# Altium project main.PrjPCB
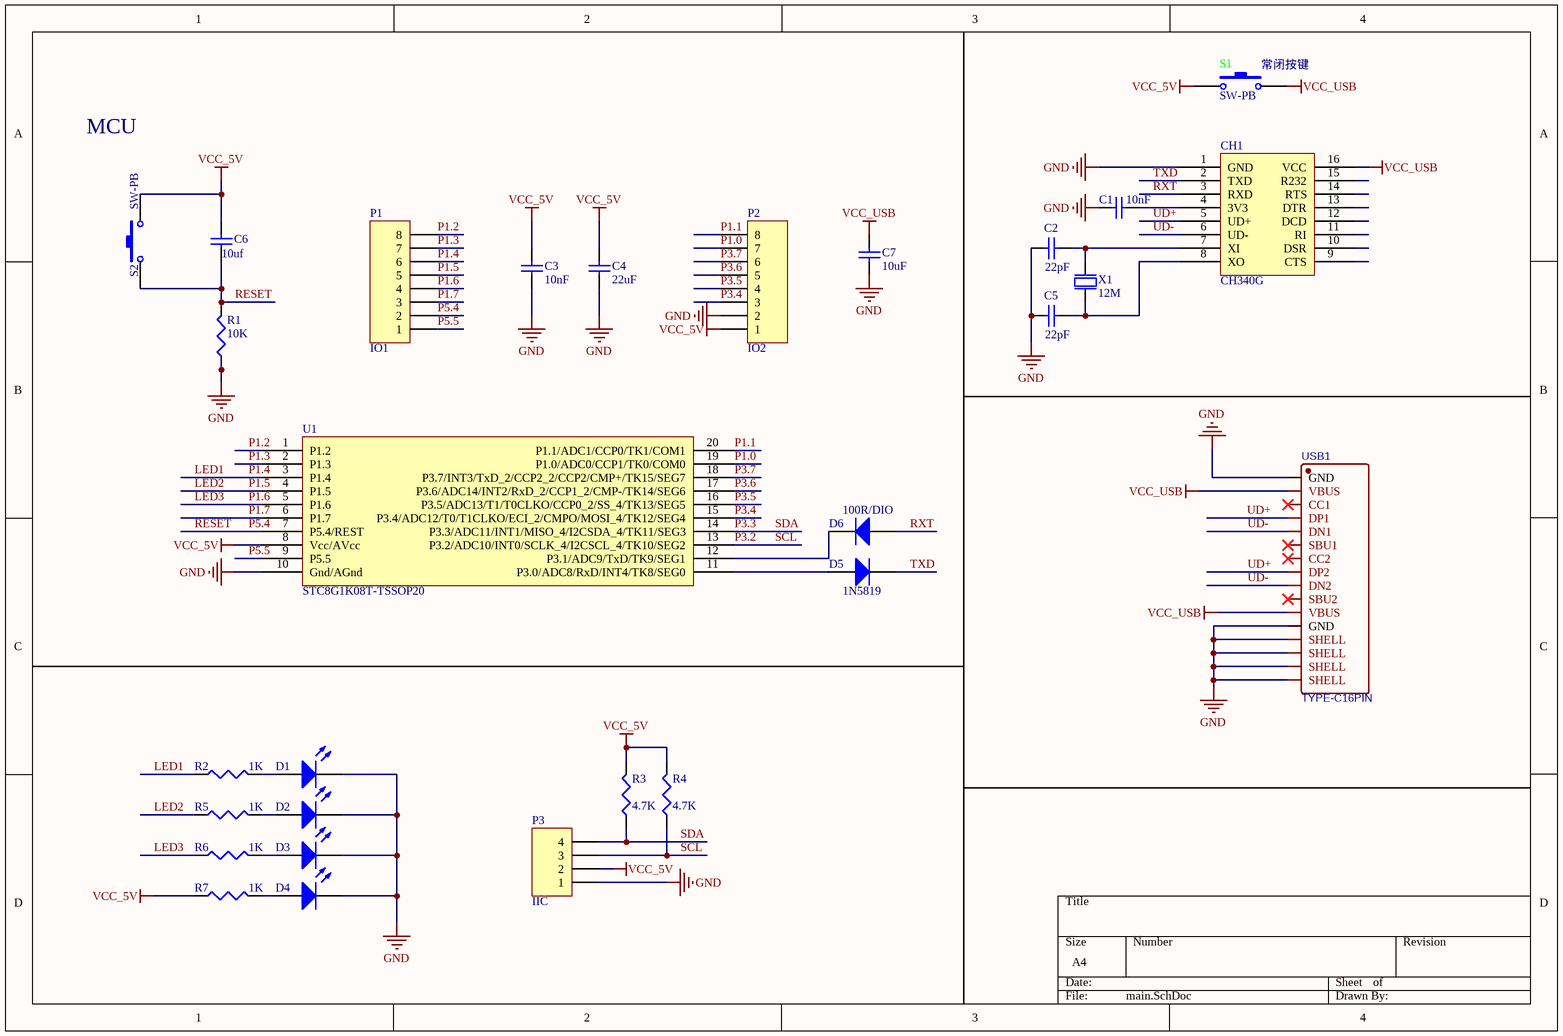
[diagram p0: main.SchDoc]
1 sheet, 29 parts. Net scope: global (net labels, ports and power ports of the same name join across sheets).
Board file: PCB1.PcbDoc

## Sheet main.SchDoc
size A4

### Parts
C1  value 10nF  [C0603]  (hidden comment: Cap Semi)
C2  value 22pF  [0402]  (hidden comment: Cap Semi)
C3  10nF  [C0603]
C4  22uF  [C0603]
C5  value 22pF  [0402]  (hidden comment: Cap Semi)
C6  value 10uf  [C0603]
C7  10uF  [C0603]
CH1  (no value)  [SOIC127P600X170-16N]
D1  LED3  [0603D]  (value not drawn)
D2  LED3  [0603D]  (value not drawn)
D3  LED3  [0603D]  (value not drawn)
D4  LED3  [0603D]  (value not drawn)
D5  100R/DIO  [0603D]
D6  1N5819  [0603D]
P1  IO1  [HDR1X8]
P2  IO2  [HDR1X8]
P3  IIC  [HDR1X4]
R1  10K  [J1-0603]
R2  1K  [J1-0603]
R3  value 4.7K  [J1-0603]  (hidden comment: Res3)
R4  value 4.7K  [J1-0603]  (hidden comment: Res3)
R5  1K  [J1-0603]
R6  1K  [J1-0603]
R7  1K  [J1-0603]
S1  SW-PB  [KEY_1]
S2  SW-PB  [KEY_1]
U1  STC8G1K08T-TSSOP20  [TSSOP20]
USB1  TYPE-C16PIN  [USB-C-SMD_TYPE-C16PIN]
X1  12M  [LC_SMD-3225_4P]

### Nets
GND: C1.2 C2.1 C3.1 C4.1 C5.1 C7.1 CH1.1(GND) D1.2(K) D2.2(K) D3.2(K) D4.2(K) P2.2 P3.1 R1.1 U1.10(Gnd/AGnd) USB1.1(SHELL) USB1.2(SHELL) USB1.3(SHELL) USB1.4(SHELL) USB1.A1B12(GND) USB1.B1A12(GND) X1.2(GND) X1.4(GND)
VCC_5V: C3.2 C4.2 C6.2 P2.1 P3.2 R3.2 R4.2 R7.1 S1.1 S2.2 U1.8(Vcc/AVcc)
VCC_USB: C7.2 CH1.16(VCC) S1.2 USB1.A4B9(VBUS) USB1.B4A9(VBUS)
LED1: P1.6 R2.1 U1.3(P1.4)  [also labelled P1.4]
LED2: P1.5 R5.1 U1.4(P1.5)  [also labelled P1.5]
LED3: P1.4 R6.1 U1.5(P1.6)  [also labelled P1.6]
P1.0: P2.7 U1.19(P1.0/ADC0/CCP1/TK0/COM0)
P1.1: P2.8 U1.20(P1.1/ADC1/CCP0/TK1/COM1)
P1.2: P1.8 U1.1(P1.2)
P1.3: P1.7 U1.2(P1.3)
P1.7: P1.3 U1.6(P1.7)
P3.2: P3.3 R4.1 U1.13(P3.2/ADC10/INT0/SCLK_4/I2CSCL_4/TK10/SEG2)  [also labelled SCL]
P3.3: P3.4 R3.1 U1.14(P3.3/ADC11/INT1/MISO_4/I2CSDA_4/TK11/SEG3)  [also labelled SDA]
P3.4: P2.3 U1.15(P3.4/ADC12/T0/T1CLKO/ECI_2/CMPO/MOSI_4/TK12/SEG4)
P3.5: P2.4 U1.16(P3.5/ADC13/T1/T0CLKO/CCP0_2/SS_4/TK13/SEG5)
P3.6: P2.5 U1.17(P3.6/ADC14/INT2/RxD_2/CCP1_2/CMP-/TK14/SEG6)
P3.7: P2.6 U1.18(P3.7/INT3/TxD_2/CCP2_2/CCP2/CMP+/TK15/SEG7)
P5.4: C6.1 P1.2 R1.2 S2.1 U1.7(P5.4/REST)  [also labelled RESET]
P5.5: P1.1 U1.9(P5.5)
RXT: CH1.3(RXD) D6.1(A)
TXD: CH1.2(TXD) D5.2(K)
UD+: CH1.5(UD+) USB1.A6(DP1) USB1.B6(DP2)
UD-: CH1.6(UD-) USB1.A7(DN1) USB1.B7(DN2)
NetC1_1: C1.1 CH1.4(3V3)
NetC2_2: C2.2 CH1.7(XI) X1.3(out)
NetC5_2: C5.2 CH1.8(XO) X1.1(inp)
NetD1_1: D1.1(A) R2.2
NetD2_1: D2.1(A) R5.2
NetD3_1: D3.1(A) R6.2
NetD4_1: D4.1(A) R7.2
NetD5_1: D5.1(A) U1.11(P3.0/ADC8/RxD/INT4/TK8/SEG0)
NetD6_2: D6.2(K) U1.12(P3.1/ADC9/TxD/TK9/SEG1)

Not connected (* = marked no-connect by the designer): CH1 9(CTS) 10(DSR) 11(RI) 12(DCD) 13(DTR) 14(RTS) 15(R232); USB1 A5(CC1)* A8(SBU1)* B5(CC2)* B8(SBU2)*

### Notes on the sheet
- (near S1) 常闭按键
- MCU
- (in symbol Component_1) CH340G

### Library data of the parts
C1-C7 = Cap Semi: Capacitor (Semiconductor SIM Model); Published: 8-Jun-2000; LatestRevisionDate: 17-Jul-2002; LatestRevisionNote: Re-released for DXP Platform.; PackageReference: C1206; Publisher: Altium Limited
CH1 = Component_1
D1-D4 = LED3: Typical BLUE SiC LED; Published: 8-Jun-2000; LatestRevisionDate: 17-Dec-2003; LatestRevisionNote: PCB Footprint replaced.; DatasheetDocument: 16-Apr-2002; PackageDocument: 16-Apr-2002; PackageReference: 3.5X2.8X1.9; Publisher: Altium Limited
D5 D6 = Diode: Default Diode; Published: 8-Jun-2000; LatestRevisionDate: 17-Jul-2002; LatestRevisionNote: Re-released for DXP Platform.; PackageVersion: Sep-1996; PackageReference: SMC; Publisher: Altium Limited; Code_JEDEC: DO-214-AB
P1 P2 = Header 8: Header, 8-Pin; LatestRevisionDate: 17-Jul-2002; LatestRevisionNote: Re-released for DXP Platform.; Publisher: Altium Limited
P3 = Header 4: Header, 4-Pin; LatestRevisionDate: 17-Jul-2002; LatestRevisionNote: Re-released for DXP Platform.; Publisher: Altium Limited
R1-R7 = Res3: Resistor; Published: 8-Jun-2000; LatestRevisionDate: 04-Mar-2005; LatestRevisionNote: PCB Footprint replaced.; PackageReference: J1-0603; Publisher: Altium Limited
S1 S2 = SW-PB: Switch; Published: 24-Mar-1999; LatestRevisionDate: 17-Jul-2002; LatestRevisionNote: Re-released for DXP Platform.; PackageReference: SPST-2; Publisher: Altium Limited
USB1 = TYPE-C16PIN: BOM_Manufacturer: SHOU HAN; Contributor: LCSC; BOM_Supplier: LCSC; BOM_Supplier Part: C393939; BOM_Manufacturer Part: TYPE-C16PIN; spicePre: U; spiceSymbolName: TYPE-C16PIN
X1 = XTAL_SMD2016_32MHz_8pF_Epson: XTAL SMD 2016, 32MHz, Cl=8pF, Tol: ?0ppm, Stab: ?0ppm; Manufacturer: Epson Toyocom; Manufacturer Part Number: Q22FA12800025; Note: XTAL SMD 32.000MHz; Artikkelnr Noca: 22019238; Artikkelnr Simpro: N.A.; Part Number: XTAL_SMD2016_32MHz_8pF_Epson; Datasheet: http://www.epsondevice.com/docs/qd/en/DownloadServlet?id=ID000449; LatestRevisionDate: 2014-11-27; Pin Count: 4; Publisher: Nordic Semiconductor; Published: 2012-03-09; Value: 32MHz; Supplier: Farnell; Supplier part number: 171-2806; 2nd source Supplier: *; 2nd source part number: *; Footprint Doc: XTAL_2016